# EAGLE schematic V1 (EAGLE 9.1.3)
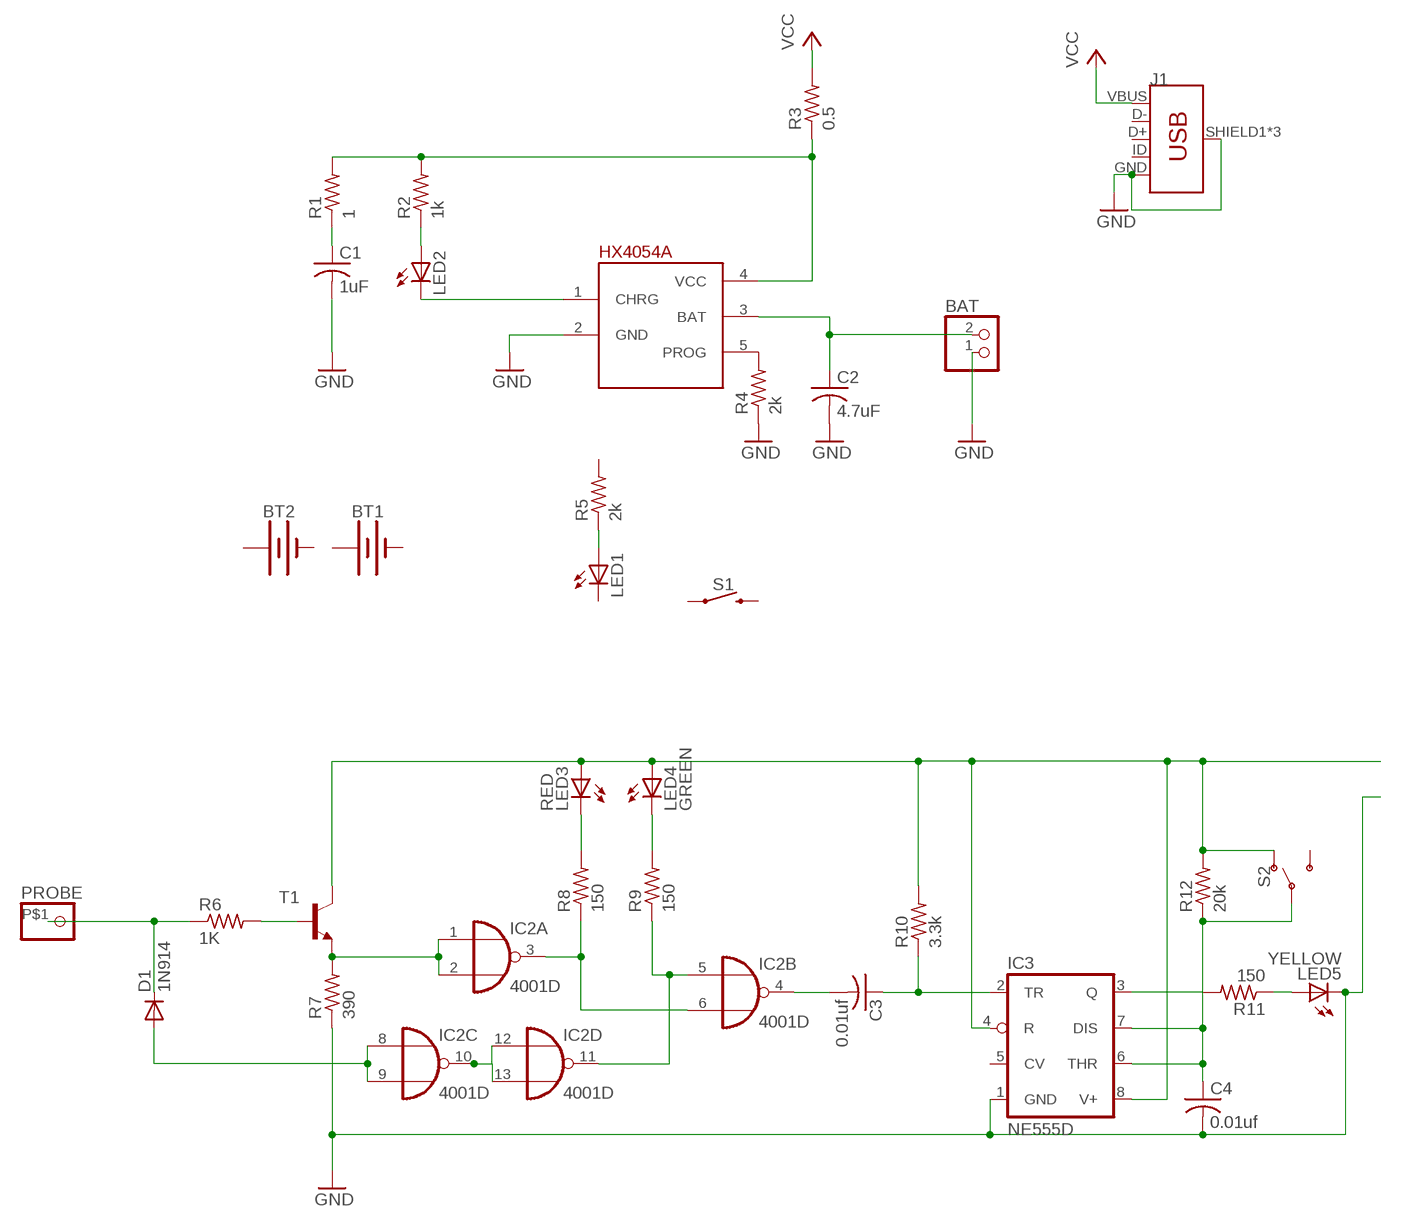
[diagram p0: schematic, sheet 1]

## Parts
BAT  JST_2PIN-SMT  [JST-PH-2-SMT]
BT1  BATTERY-12MM_SMD  [BATTCON_12MM]
BT2  BATTERY-12MM_SMD  [BATTCON_12MM]
C1  1uF  C-USC0402  [C0402]
C2  4.7uF  C-USC0402  [C0402]
C3  0.01uf  C-USC0402  [C0402]
C4  0.01uf  C-USC0402  [C0402]
D1  1N914  DIODE-SOD323-W  [SOD323-W]
IC2  4001D  [SO14]
IC3  NE555D  [SO08]
J1  USB_MICRO-BREDUCED_PASTE  [USB-B-MICRO-SMD_RED_PASTE]
LED1  LED3MM  [LED3MM]
LED2  LEDCHIP-LED0603  [CHIP-LED0603]
LED3  RED  LEDCHIP-LED0603  [CHIP-LED0603]
LED4  GREEN  LEDCHIP-LED0603  [CHIP-LED0603]
LED5  YELLOW  LEDCHIP-LED0603  [CHIP-LED0603]
PROBE  PINHD-1X1-BIGPOGO  [1X1-BIGPOGO]
R1  1  R-US_R0201  [R0201]
R2  1k  R-US_R0201  [R0201]
R3  0.5  R-US_R0402  [R0402]
R4  2k  R-US_R0201  [R0201]
R5  2k  R-US_R0603  [R0603]
R6  1K  R-US_R0402  [R0402]
R7  390  R-US_R0402  [R0402]
R8  150  R-US_R0402  [R0402]
R9  150  R-US_R0402  [R0402]
R10  3.3k  R-US_R0402  [R0402]
R11  150  R-US_R0402  [R0402]
R12  20k  R-US_R0402  [R0402]
S1  MOMENTARY-SWITCH-SPST-SMD-5.2-REDUNDANT  [TACTILE_SWITCH_SMD_5.2MM]
S2  SWITCH-SPDT-PTH-11.6X4.0MM  [SWITCH_SPDT_PTH_11.6X4.0MM]
T1  MMBT2222ALT1-NPN-SOT23-BEC  [SOT23-BEC]
U$3  HX4054A  [SOT23-5L]

## Nets
GND: BAT.1 C1.2 C2.2 C4.2 IC3.1(GND) J1.GND J1.SHIELD1(SHIELD) J1.SHIELD2(SHIELD) J1.SHIELD3(SHIELD) LED5.C R4.1 R7.1 U$3.2(GND)
N$1: C1.1 R1.1
N$2: R1.2 R2.2 R3.1 U$3.4(VCC)
N$3: LED2.A R2.1
N$4: LED2.C U$3.1(CHRG)
N$5: BAT.2 C2.1 U$3.3(BAT)
N$6: R4.2 U$3.5(PROG)
N$7: LED1.A R5.1
N$8: R6.2 T1.B
N$9: D1.C PROBE.P$1 R6.1
N$10: D1.A IC2.8(C:I0) IC2.9(C:I1)
N$11: IC2.10(C:O) IC2.12(D:I0) IC2.13(D:I1)
N$12: IC2.1(A:I0) IC2.2(A:I1) R7.2 T1.E
N$13: LED3.C R8.2
N$14: LED4.C R9.2
N$15: IC2.3(A:O) IC2.6(B:I1) R8.1
N$16: IC2.5(B:I0) IC2.11(D:O) R9.1
N$17: LED5.A R11.1
N$18: IC3.3(Q) R11.2
N$19: C3.2 IC2.4(B:O)
N$20: C3.1 IC3.2(TR) R10.1
N$21: C4.1 IC3.6(THR) IC3.7(DIS) R12.1 S2.2(P)
N$22: IC3.4(R) IC3.8(V+) LED3.A LED4.A R10.2 R12.2 S2.1(O) T1.C
VCC: J1.VBUS R3.2
Unconnected: IC3.5(CV) J1.D+ J1.D- J1.ID LED1.K(C) R5.2 S1.1 S1.2 S1.3 S1.4 S2.3(S)

## Power pins joined to a net without a drawn wire
+: BT1.PWR@1(+) BT2.PWR@1(+)
-: BT1.GND(-) BT2.GND(-)
VDD: IC2.14(P:VDD)
VSS: IC2.7(P:VSS)

## Library data of the parts
BAT = adafruit:JST_2PIN: JST 2-Pin Connectors of various flavors SMT-RA (S2B-PH-SM4) 4UConnector #17311 SMT (B2B-PH-SM4) THM-RA (S2B-PH) THM (B2B-PH)
BT1 BT2 = SparkFun-Batteries:BATTERY: Battery - Single Cell A variety of battery chemistries, sizes, and footprints. Device List: 20MM_PTH - Coin Cell Battery Holder - 20mm (PTH) <https://www.sparkfun.com/products/783> 6.8MM_PTH - Coin Cell Battery Holder - 6.8MM(SMD) <https://www.digikey.com/product-detail/en/seiko-instruments/MS621FE-FL11E/728-1057-ND/1889208?WT.srch=1&gclid=CNOQ5a6LzdQCFZS2wAodXCkE0g> 12MM_SMD - Coin Cell Battery Holder - 12mm (SMD) <https://www.sparkfun.com/products/10592> 12MM_PTH - Coin Cell Battery Holder - 12mm (PTH) <https://www.sparkfun.com/products/7948> 20MM_SMD - 20mm Coin Cell Battery Holder (SMD) (2 legs) Used on the Big Time Watch Kit <https://www.sparkfun.com/products/11734> 20MM_SMD_4LEGS - Coin Cell Battery Holder - 20mm (SMD) <https://www.sparkfun.com/products/11892> 20MM_SMD_4LEGS_OVERPASTE - Coin Cell Battery Holder - 20mm (SMD) <https://www.sparkfun.com/products/11892> (Over-paste on the legs) 24.5MM_PTH - Coin Cell Battery Holder - 24.5mm (PTH) <https://www.sparkfun.com/products/8863> 9V - 9V Battery Holder - PC Mount Used on the SparkFun SparkPunk Sound Kit <https://www.sparkfun.com/products/11177> and SparkFun SparkPunk Sequencer Kit <https://www.sparkfun.com/products/12707> 18650 - Battery Holder - 18650 (PTH) <https://www.sparkfun.com/products/13113> AA - Battery Holder - 1xAA (PTH) <https://www.sparkfun.com/products/7949> AAA - Battery Holder - 1xAAA (PTH) <https://www.sparkfun.com/products/12718> AA_KIT - Battery Holder - 1xAA (PTH) <https://www.sparkfun.com/products/7949> Special kit package - pads only have exposed copper on one side of the board. AAA_KIT - Battery Holder - 1xAAA (PTH) <https://www.sparkfun.com/products/12718> Special kit package - pads only have exposed copper on one side of the board.; PROD_ID: BATT-08044; SF_SKU: PRT-10592
C1-C4 = adafruit:C-US: CAPACITOR, American symbol
D1 = diode:DIODE-: DIODE
IC2 = 40xx:4001: Quad 2-input NOR
IC3 = linear:*555: TIMER
J1 = SparkFun-Connectors:USB_MICRO-B: USB Type Micro-B Connector Male/female and PTH/SMT variants SparkFun Products: SparkFun microB USB Breakout <https://www.sparkfun.com/products/12035> SparkFun USB microB Plug Breakout <https://www.sparkfun.com/products/10031> SparkFun ESP8266 Thing <https://www.sparkfun.com/products/13231>; PROD_ID: CONN-11752
LED1 = led:LED: LED
LED2-LED5 = adafruit:LED: LED
PROBE = adafruit:PINHD-1X1: Pin header 1x1 for 0.1" spacing With round pins
R1 R2 R4 R5 = rcl:R-US_: RESISTOR, American symbol; SPICEPREFIX: R
R3 R6-R12 = adafruit:R-US_: RESISTOR, American symbol
S1 = SparkFun-Switches:MOMENTARY-SWITCH-SPST: Momentary Switch (Pushbutton) - SPST Normally-open (NO) SPST momentary switches (buttons, pushbuttons). Variants PTH-12MM - 12mm square, through-hole Momentary Pushbutton Switch - 12mm Square <https://www.sparkfun.com/products/9190> (COM-09190) PTH-6.0MM, PTH-6.0MM-KIT - 6.0mm square, through-hole Mini Pushbutton Switch <https://www.sparkfun.com/products/97> (COM-00097) KIT package intended for soldering kit's - only one side of pads' copper is exposed. PTH-RIGHT-ANGLE-KIT - Right-angle, through-hole Right Angle Tactile Button <https://www.sparkfun.com/products/10791> - Used on SparkFun BigTime Watch Kit <https://www.sparkfun.com/products/11734> SMD-12MM - 12mm square, surface-mount Tactile Button - SMD (12mm) <https://www.sparkfun.com/products/12993> (COM-12993) Used on SparkFun PicoBoard <https://www.sparkfun.com/products/11888> SMD-4.5MM - 4.5mm Square Trackball Switch Used on SparkFun Blackberry Trackballer Breakout <https://www.sparkfun.com/products/13169> SMD-4.6MMX2.8MM - 4.60mm x 2.80mm, surface mount Used on SparkFun SAMD21 Mini Breakout <https://www.sparkfun.com/products/13664> SMD-5.2MM, SMD-5.2-REDUNDANT - 5.2mm square, surface-mount Mini Pushbutton Switch - SMD <https://www.sparkfun.com/products/8720> (COM-08720) Used on Arduino Pro Mini <https://www.sparkfun.com/products/11114> REDUNDANT package connects both switch circuits together SMD-6.0X3.5MM - 6.0 x 3.5mm, surface mount Momentary Reset Switch SMD <https://www.sparkfun.com/products/8229> (COM-08229) SMD-6.2MM-TALL - 6.2mm square, surface mount Tactile Button - SMD (6mm) <https://www.sparkfun.com/products/12992> Used on SparkFun Digital Sandbox <https://www.sparkfun.com/products/12651> SMD-RIGHT-ANGLE - Right-angle, surface mount Used on SparkFun Block for Intel® Edison - Arduino <https://www.sparkfun.com/products/13036>; PROD_ID: SWCH-08247; SF_SKU: COM-08720
S2 = SparkFun-Switches:SWITCH-SPDT: Single Pole, Double Throw (SPDT) Switch Single-pole, double-throw (SPDT) switch. Variant Overview SMD-AYZ0202 Surface Mount DPDT Switch <https://www.sparkfun.com/products/597> (COM-00597) Used on e.g. LilyPad Arduino USB - ATmega32U4 Board <https://www.sparkfun.com/products/12049> PTH-11.6X4.0MM SPDT Mini Power Switch <https://www.sparkfun.com/products/102> (COM-00102) Used on e.g. SparkFun Simon Says - Through-Hole Soldering Kit <https://www.sparkfun.com/products/10547> (KIT-10547) PTH-11.6X4.0MM-KIT KIT version of SPDT Mini Power Switch - Simplifies soldering by removing tStop of switch pins - only one side can be soldered. PTH-11.6X4.0MM-LOCK LOCK version of SPDT Mini Power Switch - Offset pins hold switch in place for easier soldering. SMD-RIGHT-ANGLE Surface Mount Right Angle Switch <https://www.sparkfun.com/products/10860> (COM-10860) Used on e.g. SparkFun ESP8266 Thing <https://www.sparkfun.com/products/13231>; PROD_ID: SWCH-08261; SF_SKU: COM-00102
T1 = transistor-neu-to92:*-NPN-: NPN Transistror
U$3 = BuisinessCard:HX4054A